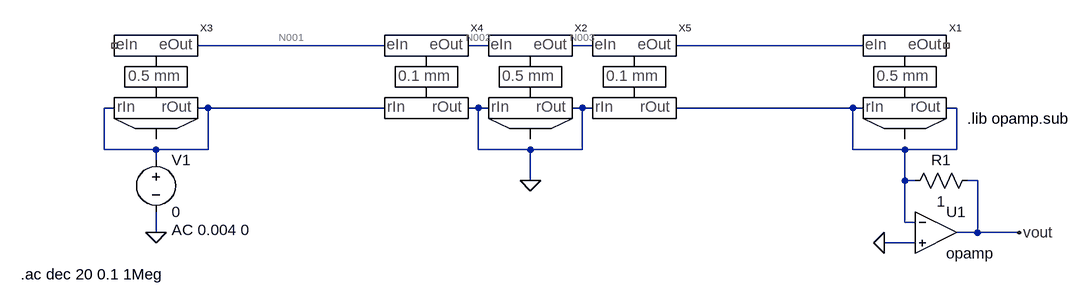
[diagram p0: schematic 0_nstCircuitSim.asc]
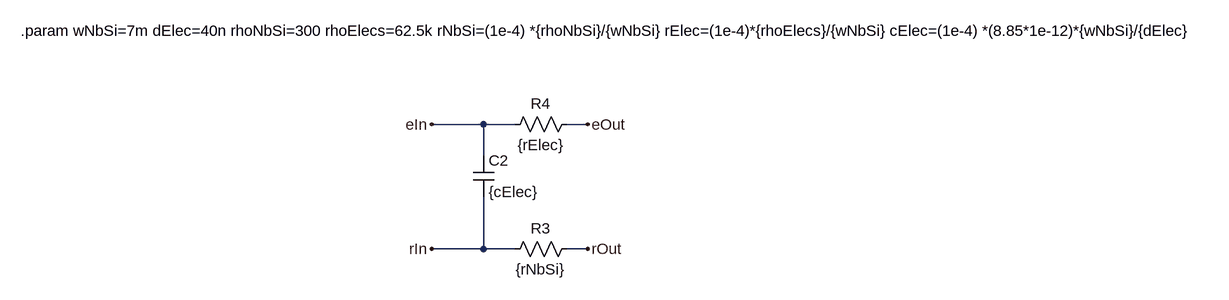
[diagram p1: sub-circuit baseunit_0p1mm.asc]
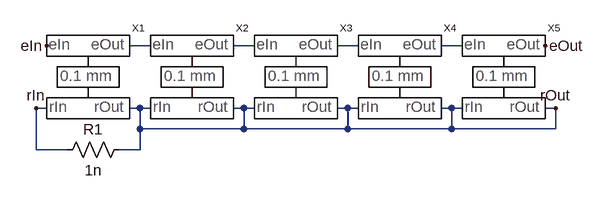
[diagram p2: sub-circuit contactunit_0p5mm.asc]
0_nstCircuitSim.asc, the LTspice schematic file:
Version 4
SHEET 1 1276 680
WIRE -48 96 -336 96
WIRE 112 96 80 96
WIRE 272 96 240 96
WIRE 688 96 400 96
WIRE -464 192 -480 192
WIRE -320 192 -336 192
WIRE -48 192 -320 192
WIRE 96 192 80 192
WIRE 112 192 96 192
WIRE 256 192 240 192
WIRE 272 192 256 192
WIRE 672 192 400 192
WIRE 688 192 672 192
WIRE 832 192 816 192
WIRE -480 256 -480 192
WIRE -400 256 -480 256
WIRE -320 256 -320 192
WIRE -320 256 -400 256
WIRE 96 256 96 192
WIRE 176 256 96 256
WIRE 256 256 256 192
WIRE 256 256 176 256
WIRE 672 256 672 192
WIRE 752 256 672 256
WIRE 832 256 832 192
WIRE 832 256 752 256
WIRE -400 272 -400 256
WIRE 176 304 176 256
WIRE 752 304 752 256
WIRE 768 304 752 304
WIRE 864 304 848 304
WIRE 752 368 752 304
WIRE 768 368 752 368
WIRE -400 384 -400 352
WIRE 864 384 864 304
WIRE 864 384 832 384
WIRE 928 384 864 384
WIRE 768 400 720 400
FLAG 176 304 0
FLAG -400 384 0
FLAG 928 384 vout
FLAG 720 400 0
SYMBOL voltage -400 256 R0
WINDOW 123 24 124 Left 2
WINDOW 39 0 0 Left 0
SYMATTR Value2 AC 0.004 0
SYMATTR InstName V1
SYMATTR Value 0
SYMBOL OpAmps\\opamp 800 320 R0
SYMATTR InstName U1
SYMBOL res 864 288 R90
WINDOW 0 0 56 VBottom 2
WINDOW 3 32 56 VTop 2
SYMATTR InstName R1
SYMATTR Value 1
SYMBOL baseUnit_0p1mm 16 144 R0
SYMATTR InstName X4
SYMBOL baseUnit_0p1mm 336 144 R0
SYMATTR InstName X5
SYMBOL contactUnit_0p5mm 752 144 R0
SYMATTR InstName X1
SYMBOL contactUnit_0p5mm 176 144 R0
SYMATTR InstName X2
SYMBOL contactUnit_0p5mm -400 144 R0
SYMATTR InstName X3
TEXT 848 208 Left 2 !.lib opamp.sub
TEXT -608 448 Left 2 !.ac dec 20 0.1 1Meg

baseunit_0p1mm.asc, the sub-circuit schematic file:
Version 4
SHEET 1 17700 1016
WIRE 464 -16 384 -16
WIRE 512 -16 464 -16
WIRE 624 -16 592 -16
WIRE 464 32 464 -16
WIRE 464 176 464 96
WIRE 464 176 384 176
WIRE 512 176 464 176
WIRE 624 176 592 176
FLAG 384 -16 eIn
FLAG 624 -16 eOut
FLAG 384 176 rIn
FLAG 624 176 rOut
SYMBOL res 608 160 R90
WINDOW 0 0 56 VBottom 2
WINDOW 3 32 56 VTop 2
SYMATTR InstName R3
SYMATTR Value {rNbSi}
SYMBOL res 608 -32 R90
WINDOW 0 0 56 VBottom 2
WINDOW 3 32 56 VTop 2
SYMATTR InstName R4
SYMATTR Value {rElec}
SYMBOL cap 448 32 R0
SYMATTR InstName C2
SYMATTR Value {cElec}
TEXT -248 -160 Left 2 !.param wNbSi=7m dElec=40n rhoNbSi=300 rhoElecs=62.5k rNbSi=(1e-4) *{rhoNbSi}/{wNbSi} rElec=(1e-4)*{rhoElecs}/{wNbSi} cElec=(1e-4) *(8.85*1e-12)*{wNbSi}/{dElec}

contactunit_0p5mm.asc, the sub-circuit schematic file:
Version 4
SHEET 1 880 680
WIRE 112 80 80 80
WIRE 272 80 240 80
WIRE 432 80 400 80
WIRE 592 80 560 80
WIRE -48 176 -64 176
WIRE 96 176 80 176
WIRE 112 176 96 176
WIRE 256 176 240 176
WIRE 272 176 256 176
WIRE 416 176 400 176
WIRE 432 176 416 176
WIRE 576 176 560 176
WIRE 592 176 576 176
WIRE 736 176 720 176
WIRE 96 208 96 176
WIRE 256 208 256 176
WIRE 256 208 96 208
WIRE 416 208 416 176
WIRE 416 208 256 208
WIRE 576 208 576 176
WIRE 576 208 416 208
WIRE 736 208 736 176
WIRE 736 208 576 208
WIRE -64 240 -64 176
WIRE -16 240 -64 240
WIRE 96 240 96 208
WIRE 96 240 64 240
FLAG -48 80 eIn
FLAG -64 176 rIn
FLAG 720 80 eOut
FLAG 736 176 rOut
SYMBOL baseUnit_0p1mm 16 128 R0
SYMATTR InstName X1
SYMBOL baseUnit_0p1mm 176 128 R0
SYMATTR InstName X2
SYMBOL baseUnit_0p1mm 336 128 R0
SYMATTR InstName X3
SYMBOL baseUnit_0p1mm 496 128 R0
SYMATTR InstName X4
SYMBOL baseUnit_0p1mm 656 128 R0
SYMATTR InstName X5
SYMBOL res 80 224 R90
WINDOW 0 0 56 VBottom 2
WINDOW 3 32 56 VTop 2
SYMATTR InstName R1
SYMATTR Value 1n

The netlist it stands for:
* 0_nstCircuitSim.asc
V1 N005 0 0 AC 0.004 0
XU1 N006 0 vout opamp Aol=100K GBW=10Meg  ; pins invin noninvin out
R1 vout N006 1
XX4 N001 N002 N005 0 baseunit_0p1mm
XX5 N003 N004 0 N006 baseunit_0p1mm
XX1 N004 NC_01 N006 N006 contactunit_0p5mm
XX2 N002 N003 0 0 contactunit_0p5mm
XX3 NC_02 N001 N005 N005 contactunit_0p5mm

* block symbol definitions
.subckt baseunit_0p1mm eIn eOut rIn rOut
R3 rOut rIn {rNbSi}
R4 eOut eIn {rElec}
C2 eIn rIn {cElec}
.param wNbSi=7m dElec=40n rhoNbSi=300 rhoElecs=62.5k rNbSi=(1e-4) *{rhoNbSi}/{wNbSi} rElec=(1e-4)*{rhoElecs}/{wNbSi} cElec=(1e-4) *(8.85*1e-12)*{wNbSi}/{dElec}
.ends baseunit_0p1mm

.subckt contactunit_0p5mm eIn eOut rIn rOut
XX1 eIn N001 rIn rOut baseunit_0p1mm
XX2 N001 N002 rOut rOut baseunit_0p1mm
XX3 N002 N003 rOut rOut baseunit_0p1mm
XX4 N003 N004 rOut rOut baseunit_0p1mm
XX5 N004 eOut rOut rOut baseunit_0p1mm
R1 rOut rIn 1n
.ends contactunit_0p5mm

.lib opamp.sub
.ac dec 20 0.1 1Meg
.backanno
.end

* Results of the author's LTspice run, read from the files saved beside the schematic
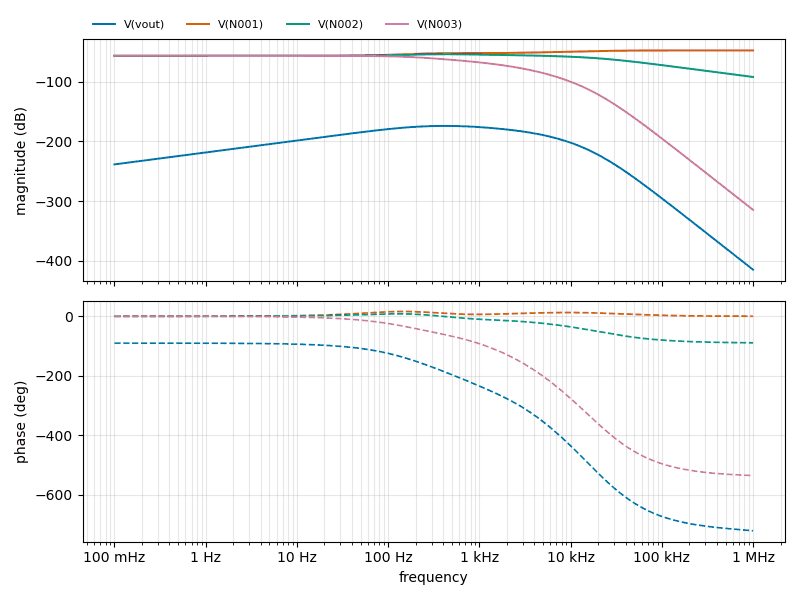
[diagram p3: AC Analysis of 0_nstCircuitSim.asc, plotted from the saved traces]
* AC Analysis, 1 run:
*   V(vout): -238.58 dB at 100 mHz, -414.69 dB at 1 MHz, peak -174.26 dB at 398.1 Hz, 3 dB below the peak at 144.6 Hz and 1.242 kHz
*   V(N001): -57.00 dB at 100 mHz, -47.96 dB at 1 MHz, peak -47.96 dB at 1 MHz, 3 dB below the peak at 5.819 kHz
*   V(N002): -57.00 dB at 100 mHz, -92.41 dB at 1 MHz, peak -54.33 dB at 446.7 Hz, 3 dB below the peak at 6.126 kHz
*   V(N003): -57.00 dB at 100 mHz, -314.63 dB at 1 MHz, peak -57.00 dB at 100 mHz, 3 dB below the peak at 229.1 Hz